# EAGLE board DumbBadgeFusion (EAGLE 9.6.2), part 1 of 2
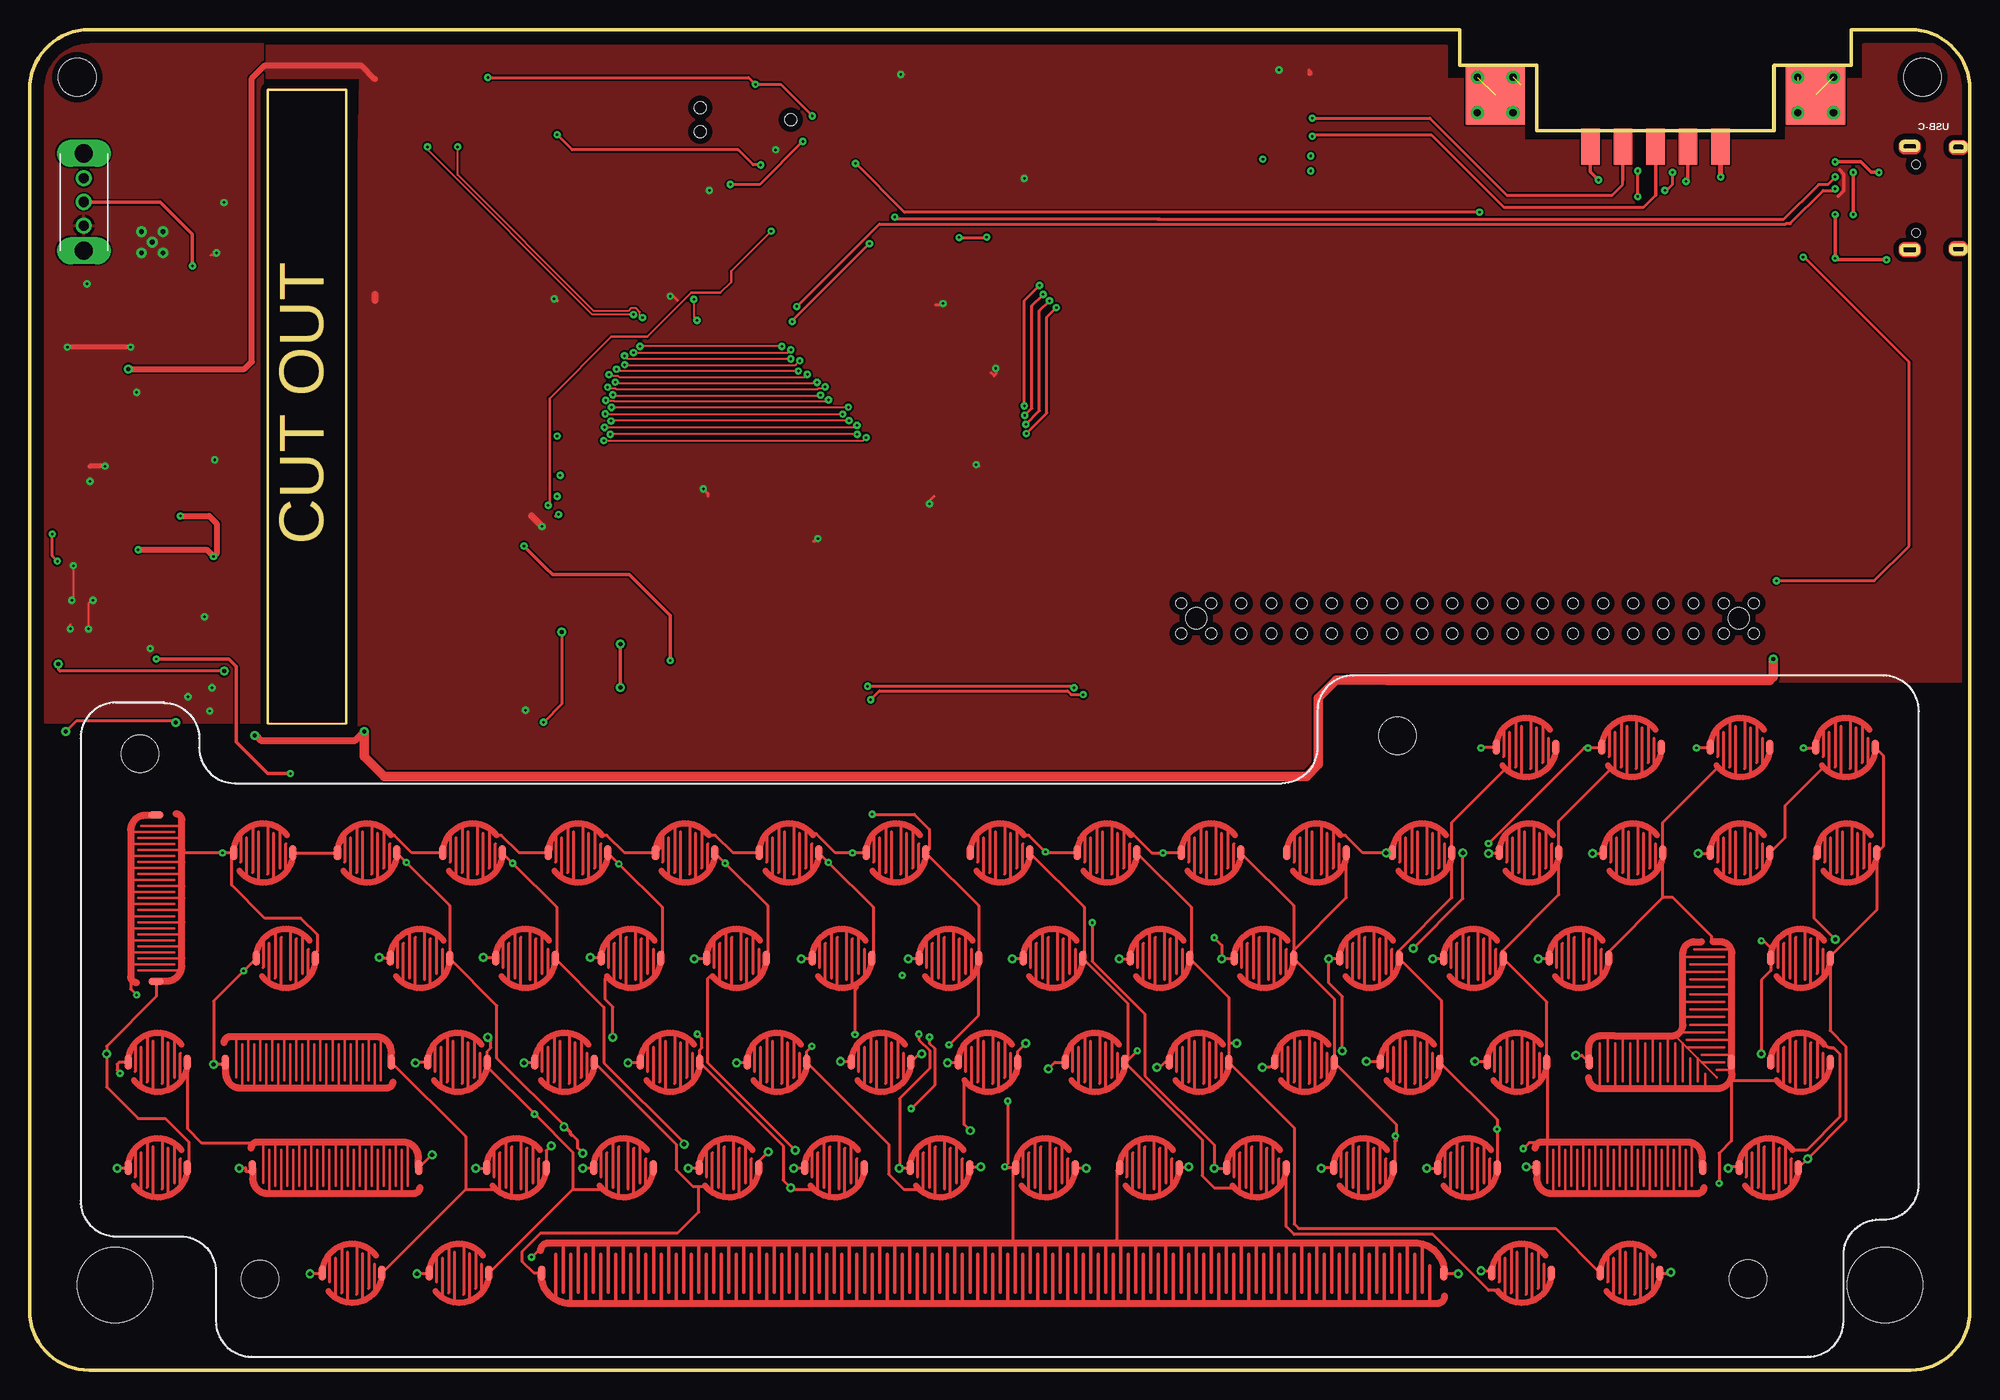
[diagram p3: board, top side]
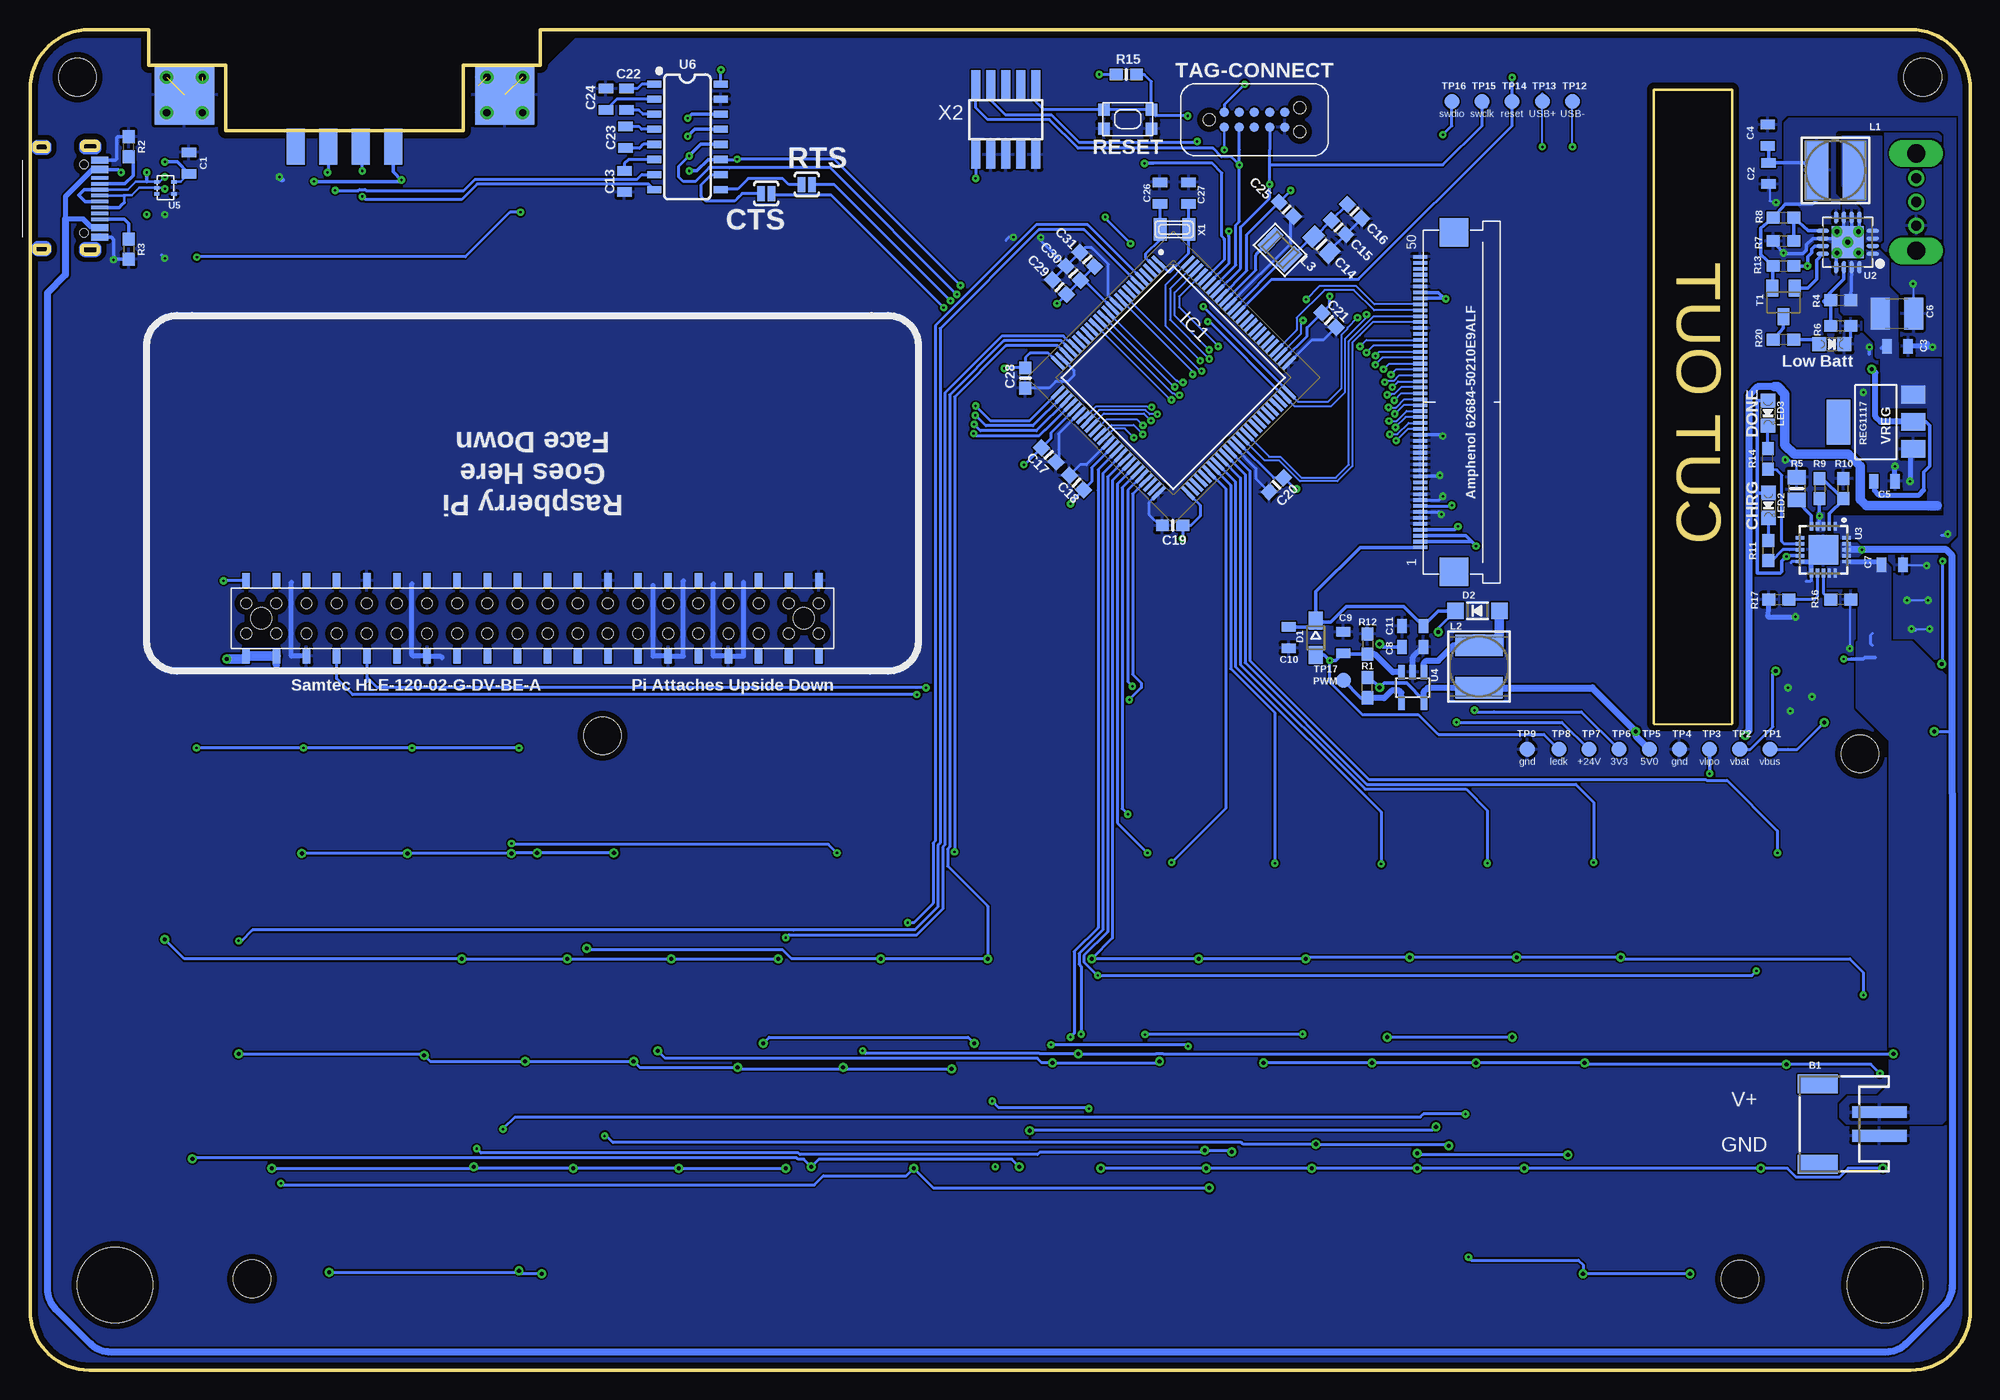
[diagram p4: board, bottom side, seen from below]

Size 163.5 x 113 mm. Coordinates in mm from the lower left corner, seen from the top.
Outline: 20.07,107.95 20.19,107.95
Outline: 20.19,107.95 20.32,107.95
Outline: 20.32,107.95 20.45,107.95
Outline: 20.45,107.95 20.57,107.95
Outline: 20.57,107.95 20.7,107.95
Outline: 20.7,107.95 20.95,107.95
Outline: 20.95,107.95 26.67,107.95
Outline: 26.67,107.95 26.67,54.48
Outline: 26.67,54.48 20.07,54.48
Outline: 20.07,54.48 20.07,55.37
Outline: 20.07,55.37 20.07,107.44
Outline: 20.07,107.44 20.07,107.57
Outline: 20.07,107.57 20.07,107.82
Outline: 20.07,107.82 20.07,107.95
Outline: 20.32,107.95 20.45,107.95
Outline: 20.45,107.95 20.57,107.95
Outline: 20.57,107.95 20.7,107.95
Outline: 20.7,107.95 20.95,107.95
Outline: 20.95,107.95 26.67,107.95
Outline: 26.67,107.95 26.67,54.48
Outline: 26.67,54.48 20.07,54.48
Outline: 20.07,54.48 20.07,55.37
Outline: 20.07,55.37 20.07,107.44
Outline: 20.07,107.44 20.07,107.57
Outline: 20.07,107.57 20.07,107.82
Outline: 20.07,107.82 20.07,107.95
Outline: 20.07,107.95 20.19,107.95
Outline: 20.19,107.95 20.32,107.95
Outline: 20.32,107.95 20.45,107.95
Outline: 20.45,107.95 20.57,107.95
Outline: 20.57,107.95 20.7,107.95
Outline: 20.7,107.95 20.95,107.95
Outline: 20.95,107.95 20.19,107.95
Outline: 158.5,0 arc90 163.5,5 163.5,108 arc90 158.5,113 153.5,113 153.5,110 147,110 147,104.5 127,104.5 127,110 120.5,110 120.5,113 5,113 arc90 0,108 0,5 arc90 5,0 158.5,0
Outline: 162.15,103.48 162.89,103.48 arc-90 163.14,103.23 163.14,102.95 arc-90 162.84,102.77 162.18,102.77 arc-90 161.93,102.89 161.93,103.25 arc-90 162.15,103.48
Outline: 158.04,103.58 158.83,103.58 arc-90 159.16,103.25 159.16,103.02 arc-90 158.85,102.84 158.04,102.84 arc-90 157.71,103.05 157.71,103.25 arc-90 158.04,103.58
Outline: 158.01,94.79 158.85,94.79 arc-90 159.16,94.61 159.16,94.36 arc-90 158.88,94.08 158.01,94.08 arc-90 157.71,94.39 157.71,94.61 arc-90 158.01,94.79
Outline: 162.2,94.84 162.81,94.84 arc-90 163.14,94.64 163.14,94.41 arc-90 162.87,94.13 162.2,94.13 arc-90 161.9,94.44 161.9,94.67 arc-90 162.2,94.84
Copper layers (1*16): Top 0.035mm / dielectric 1.5mm / Bottom 0.035mm
Design rules "default *": minimum track width 3mil, minimum drill 7mil, track to track 6mil, track to pad 6mil, pad to pad 6mil, via to via 6mil, smd to smd 6mil, copper to edge 20mil, drill to drill 6mil, minimum pad ring 10mil, minimum via ring 8mil, stop-mask expansion 4mil, vias tented up to drill 25mil, thermal gap 10mil
Net classes: 1 diff_pairs: width 0.254 mm, clearance 0.102 mm
Holes 3.15 mm at 115.26,53.48 144.8,7.7 19.41,7.69 9.29,51.98
Holes 3.17 mm at 4,109 159.5,109
Holes 6.35 mm at 7.17,7.17 156.32,7.17
bRestrict: area 20.1,54.5 to 26.7,108
Milling: 22 lines

## Footprints (pad centres in the part's own frame; a part is rotated, then mirrored left to right if it is on the bottom)
JSTPH2 = smd 1 x 4.6: 1 -1,-3.7; 2 1,-3.7 | smd 1.6 x 3.4: NC1 -3.4,1.5; NC2 3.4,1.5
0805 = smd 0.8 x 1.2: 1 -0.9,0; 2 0.9,0
C1210 = smd 1.6 x 2.7: 1 -1.4,0; 2 1.4,0
0805-NO = smd 1.24 x 1.5: 1 -0.95,0; 2 0.95,0
0603-NO = smd 1.075 x 1: 1 -0.85,0; 2 0.85,0
SOD323-W = smd 1.5 x 1.2: A 1.45,0; C -1.45,0
SOD-123 = smd 1.4 x 1.4: A 1.85,0; C -1.85,0
DE09S065TLF = drill 0.6: G1 -15,4.5; G2 -12,4.5; G3 -15,1.5; G4 -12,1.5; G5 12,4.5; G6 15,4.5; G7 12,1.5; G8 15,1.5 | smd 5 x 5 bottom: G9 13.5,3; G10 -13.5,3 | smd 5 x 5: G11 -13.5,3; G12 13.5,3 | smd 1.54 x 3: P1 5.48,-1.37; P2 2.74,-1.37; P3 0,-1.37; P4 -2.74,-1.37; P5 -5.48,-1.37 | smd 1.54 x 3 bottom: P6 4.11,-1.37; P7 1.37,-1.37; P8 -1.37,-1.37; P9 -4.11,-1.37
62684-501100ALF = smd 0.3 x 1.2: A1 -12.25,0.25; A2 -11.75,0.25; A3 -11.25,0.25; A4 -10.75,0.25; A5 -10.25,0.25; A6 -9.75,0.25; A7 -9.25,0.25; A8 -8.75,0.25; A9 -8.25,0.25; A10 -7.75,0.25; A11 -7.25,0.25; A12 -6.75,0.25; A13 -6.25,0.25; A14 -5.75,0.25; A15 -5.25,0.25; A16 -4.75,0.25; A17 -4.25,0.25; A18 -3.75,0.25; A19 -3.25,0.25; A20 -2.75,0.25; A21 -2.25,0.25; A22 -1.75,0.25; A23 -1.25,0.25; A24 -0.75,0.25; A25 -0.25,0.25; A26 0.25,0.25; A27 0.75,0.25; A28 1.25,0.25; A29 1.75,0.25; A30 2.25,0.25; A31 2.75,0.25; A32 3.25,0.25; A33 3.75,0.25; A34 4.25,0.25; A35 4.75,0.25; A36 5.25,0.25; A37 5.75,0.25; A38 6.25,0.25; A39 6.75,0.25; A40 7.25,0.25; A41 7.75,0.25; A42 8.25,0.25; A43 8.75,0.25; A44 9.25,0.25; A45 9.75,0.25; A46 10.25,0.25; A47 10.75,0.25; A48 11.25,0.25; A49 11.75,0.25; A50 12.25,0.25 | smd 2.4 x 2.4: S1 -14.3,-2.6; S2 14.3,-2.6
QFP50P1600X1600X120-100N = smd 1.475 x 0.3: 1 -7.738,6; 2 -7.738,5.5; 3 -7.738,5; 4 -7.738,4.5; 5 -7.738,4; 6 -7.738,3.5; 7 -7.738,3; 8 -7.738,2.5; 9 -7.738,2; 10 -7.738,1.5; 11 -7.738,1; 12 -7.738,0.5; 13 -7.738,0; 14 -7.738,-0.5; 15 -7.738,-1; 16 -7.738,-1.5; 17 -7.738,-2; 18 -7.738,-2.5; 19 -7.738,-3; 20 -7.738,-3.5; 21 -7.738,-4; 22 -7.738,-4.5; 23 -7.738,-5; 24 -7.738,-5.5; 25 -7.738,-6; 51 7.738,-6; 52 7.738,-5.5; 53 7.738,-5; 54 7.738,-4.5; 55 7.738,-4; 56 7.738,-3.5; 57 7.738,-3; 58 7.738,-2.5; 59 7.738,-2; 60 7.738,-1.5; 61 7.738,-1; 62 7.738,-0.5; 63 7.738,0; 64 7.738,0.5; 65 7.738,1; 66 7.738,1.5; 67 7.738,2; 68 7.738,2.5; 69 7.738,3; 70 7.738,3.5; 71 7.738,4; 72 7.738,4.5; 73 7.738,5; 74 7.738,5.5; 75 7.738,6 | smd 0.3 x 1.475: 26 -6,-7.738; 27 -5.5,-7.738; 28 -5,-7.738; 29 -4.5,-7.738; 30 -4,-7.738; 31 -3.5,-7.738; 32 -3,-7.738; 33 -2.5,-7.738; 34 -2,-7.738; 35 -1.5,-7.738; 36 -1,-7.738; 37 -0.5,-7.738; 38 0,-7.738; 39 0.5,-7.738; 40 1,-7.738; 41 1.5,-7.738; 42 2,-7.738; 43 2.5,-7.738; 44 3,-7.738; 45 3.5,-7.738; 46 4,-7.738; 47 4.5,-7.738; 48 5,-7.738; 49 5.5,-7.738; 50 6,-7.738; 76 6,7.738; 77 5.5,7.738; 78 5,7.738; 79 4.5,7.738; 80 4,7.738; 81 3.5,7.738; 82 3,7.738; 83 2.5,7.738; 84 2,7.738; 85 1.5,7.738; 86 1,7.738; 87 0.5,7.738; 88 0,7.738; 89 -0.5,7.738; 90 -1,7.738; 91 -1.5,7.738; 92 -2,7.738; 93 -2.5,7.738; 94 -3,7.738; 95 -3.5,7.738; 96 -4,7.738; 97 -4.5,7.738; 98 -5,7.738; 99 -5.5,7.738; 100 -6,7.738
SILICONE_SWITCH = smd 0.635 x 1.27: P$1 -2.5,0; P$2 2.5,0
SILICONE_SWITCH_2U = smd 0.635 x 1.27: P$1 -7,0; P$2 7,0
SILICONE_RETURN = smd 0.635 x 1.27: P$1 -6,0; P$2 6,0
SILICONE_SPACE = smd 0.635 x 1.27: P$1 -38,0; P$2 38,0
INDUCTOR_5X5MM_TDK_VLC5045 = smd 2 x 5: P$1 -1.6,0; P$2 1.6,0
INDUCTOR_5X5MM_NR5040_NOTHERMALS = smd 1.8 x 4: P$1 -1.8,0; P$2 1.8,0
INDUCTOR_1007 = smd 1.016 x 2.2: P$1 -1.127,0; P$2 1.127,0
CHIPLED_0805_NOOUTLINE = smd 1.2 x 1.2: A 0,-1.05; C 0,1.05
0603 = smd 1.1 x 1: 1 -0.85,0; 2 0.85,0
SJ_2S-NO = smd 0.635 x 1.27: 1 -0.45,0; 2 0.45,0
KMR2 = smd 1 x 1: 1 2,0.8; 2 2,-0.8; 3 -2,0.8; 4 -2,-0.8
SC59-BEC = smd 1 x 1.4: B -0.95,-1.2; C 0,1.2; E 0.95,-1.2
TC2050-IDC-NL = smd 0.787 x 0.787: P$1 -2.54,-0.635; P$2 -1.27,-0.635; P$3 0,-0.635; P$4 1.27,-0.635; P$5 2.54,-0.635; P$6 2.54,0.635; P$7 1.27,0.635; P$8 0,0.635; P$9 -1.27,0.635; P$10 -2.54,0.635 | hole 0.991: 3.81,1.016; 3.81,-1.016; -3.81,0
B1,27 = smd 1.27 x 1.27: TP 0,0
PVQFN-16 = smd 1.05 x 0.35: 1 -2.1,0.975; 2 -2.1,0.325; 3 -2.1,-0.325; 4 -2.1,-0.975; 9 2.1,-0.975; 10 2.1,-0.325; 11 2.1,0.325; 12 2.1,0.975 | smd 0.35 x 1.05: 5 -0.975,-2.1; 6 -0.325,-2.1; 7 0.325,-2.1; 8 0.975,-2.1; 13 0.975,2.1; 14 0.325,2.1; 15 -0.325,2.1; 16 -0.975,2.1 | drill 0.4: P$18 0,0; P$19 -0.9,0.9; P$20 0.9,0.9; P$21 0.9,-0.9; P$22 -0.9,-0.9 | smd 2.7 x 2.7: THERMAL 0,0
QFN20_4MM = smd 0.73 x 0.28: P$1 -1.965,1; P$2 -1.965,0.5; P$3 -1.965,0; P$4 -1.965,-0.5; P$5 -1.965,-1; P$11 1.965,-1; P$12 1.965,-0.5; P$13 1.965,0; P$14 1.965,0.5; P$15 1.965,1 | smd 0.28 x 0.73: P$6 -1,-1.965; P$7 -0.5,-1.965; P$8 0,-1.965; P$9 0.5,-1.965; P$10 1,-1.965; P$16 1,1.965; P$17 0.5,1.965; P$18 0,1.965; P$19 -0.5,1.965; P$20 -1,1.965 | smd 2.5 x 2.5: P$21 0,0
SOT23-5@1 = smd 0.55 x 1.2: 1 -0.95,-1.3; 2 0,-1.3; 3 0.95,-1.3; 4 0.95,1.3; 5 -0.95,1.3
SOT(5) = smd 0.3 x 0.45: GND 0.5,-0.725; IO1 -0.5,-0.725; IO2 0,-0.725; IO3 0.5,0.725; VCC -0.5,0.725
SO16 = smd 0.6 x 1.2: 1 -4.445,-2.8; 2 -3.175,-2.8; 3 -1.905,-2.8; 4 -0.635,-2.8; 5 0.635,-2.8; 6 1.905,-2.8; 7 3.175,-2.8; 8 4.445,-2.8; 9 4.445,2.8; 10 3.175,2.8; 11 1.905,2.8; 12 0.635,2.8; 13 -0.635,2.8; 14 -1.905,2.8; 15 -3.175,2.8; 16 -4.445,2.8
OS102011MA1QN1 = drill 1.524 pad 2 long: CASE1 0,0; CASE2 8.204,0 | drill 0.85 pad 1.27: P$1 2.108,0; P$2 4.115,0; P$3 6.121,0
HLE-120-02-G-DV-BE-A--REVERSEMOUNT = smd 0.635 x 1.27: P1 24.13,-3.175; P2 24.13,3.175; P3 21.59,-3.175; P4 21.59,3.175; P5 19.05,-3.175; P6 19.05,3.175; P7 16.51,-3.175; P8 16.51,3.175; P9 13.97,-3.175; P10 13.97,3.175; P11 11.43,-3.175; P12 11.43,3.175; P13 8.89,-3.175; P14 8.89,3.175; P15 6.35,-3.175; P16 6.35,3.175; P17 3.81,-3.175; P18 3.81,3.175; P19 1.27,-3.175; P20 1.27,3.175; P21 -1.27,-3.175; P22 -1.27,3.175; P23 -3.81,-3.175; P24 -3.81,3.175; P25 -6.35,-3.175; P26 -6.35,3.175; P27 -8.89,-3.175; P28 -8.89,3.175; P29 -11.43,-3.175; P30 -11.43,3.175; P31 -13.97,-3.175; P32 -13.97,3.175; P33 -16.51,-3.175; P34 -16.51,3.175; P35 -19.05,-3.175; P36 -19.05,3.175; P37 -21.59,-3.175; P38 -21.59,3.175; P39 -24.13,-3.175; P40 -24.13,3.175 | hole 0.9: 1.27,1.27; 3.81,1.27; 6.35,1.27; 8.89,1.27; 11.43,1.27; 13.97,1.27; 16.51,1.27; 19.05,1.27; 21.59,1.27; 24.13,1.27; 24.13,-1.27; 21.59,-1.27; 19.05,-1.27; 16.51,-1.27; 13.97,-1.27; 11.43,-1.27; 8.89,-1.27; 6.35,-1.27; 3.81,-1.27; 1.27,-1.27; -1.27,-1.27; -3.81,-1.27; -6.35,-1.27; -8.89,-1.27; -11.43,-1.27; -13.97,-1.27; -16.51,-1.27; -19.05,-1.27; -21.59,-1.27; -24.13,-1.27; -24.13,1.27; -21.59,1.27; -19.05,1.27; -16.51,1.27; -13.97,1.27; -11.43,1.27; -8.89,1.27; -6.35,1.27; -3.81,1.27; -1.27,1.27 | hole 1.778: -22.86,0; 22.86,0
TYPE-C-31-M-12 = smd 0.6 x 1.45: A1B12 -3.25,0.8; A4B9 -2.45,0.8; B1A12 3.25,0.8; B4A9 2.45,0.8 | smd 0.3 x 1.45: A5 -1.25,0.8; A6 -0.25,0.8; A7 0.25,0.8; A8 1.25,0.8; B5 1.75,0.8; B6 0.75,0.8; B7 -0.75,0.8; B8 -1.75,0.8 | hole 0.7: -2.89,-0.53; 2.89,-0.53
SOT223 = smd 1.499 x 2.007: 1 -2.261,-3.15; 2 0.025,-3.15; 3 2.311,-3.15 | smd 3.81 x 2.007: 4 0,3.15
XTAL3215 = smd 1.1 x 1.9: P$1 1.2,0; P$2 -1.2,0
1365-10 = smd 0.76 x 2.4: 1 -2.54,-2.95; 2 -2.54,2.95; 3 -1.27,-2.95; 4 -1.27,2.95; 5 0,-2.95; 6 0,2.95; 7 1.27,-2.95; 8 1.27,2.95; 9 2.54,-2.95; 10 2.54,2.95

## Placement (x,y rotation side)
B1  JST 2-PH  [JSTPH2]  11.36,20.75 90 bottom
C1  0.1uF  [0805]  150.11,101.75 90 bottom
C2  10uF  [0805]  17,100.88 270 bottom
C3  2.2uF  [0805]  6.14,86.31 0 bottom
C4  0.1uF  [0805]  17.08,104.1 90 bottom
C5  1.0uF  [0805]  7.24,74.93 0 bottom
C6  100uF  [C1210]  6.18,89.07 0 bottom
C7  10uF  [0805]  6.59,67.89 0 bottom
C8  10uF  [0805]  46.99,60.96 0 bottom
C9  0.1uF  [0805]  52.83,61.34 90 bottom
C10  1.0uF  [0805]  57.43,61.76 270 bottom
C11  1.0uF  [0805]  46.99,62.74 180 bottom
C13  1.0uF  [0805]  113.41,100.2 270 bottom
C14  10uF  [0805-NO]  54.67,94.89 315 bottom
C15  1uF  [0603-NO]  53.24,96.33 315 bottom
C16  .1u  [0603-NO]  51.89,97.68 135 bottom
C17  .1u  [0603-NO]  77.66,77.15 135 bottom
C18  .1u  [0603-NO]  75.32,74.82 315 bottom
C19  .1u  [0603-NO]  67.22,71.22 0 bottom
C20  .1u  [0603-NO]  58.48,74.63 45 bottom
C21  .1u  [0603-NO]  54.04,88.52 135 bottom
C22  0.1uF  [0805]  113.25,107.12 270 bottom
C23  0.1uF  [0805]  113.32,103.92 270 bottom
C24  0.1uF  [0805]  114.97,107.13 90 bottom
C25  .1u  [0603-NO]  57.64,97.85 135 bottom
C26  22pF  [0805]  68.29,99.23 270 bottom
C27  22pF  [0805]  65.88,99.23 270 bottom
C28  .1u  [0603-NO]  79.63,83.64 90 bottom
C29  .1u  [0603-NO]  76.76,91.3 315 bottom
C30  .1u  [0603-NO]  75.59,92.46 315 bottom
C31  .1u  [0603-NO]  74.42,93.63 315 bottom
D1  MM3Z24VT1G  [SOD323-W]  55.16,61.75 270 bottom
D2  MBR0540  [SOD-123]  41.53,64.01 0 bottom
DE9FEMALE  EDGEMOUNTDE9  [DE09S065TLF]  137,104.5 0 top
FPC50CONN  50PINFPC  [62684-501100ALF]  46.1,81.6 90 bottom
IC1  ATSAMD51N19A-AU  [QFP50P1600X1600X120-100N]  67.16,83.67 315 bottom
K-1  1U_PAD  [SILICONE_SWITCH]  28.44,43.6 0 top
K-2  1U_PAD  [SILICONE_SWITCH]  37.33,43.6 0 top
K-5  1U_PAD  [SILICONE_SWITCH]  64,43.6 0 top
K_0  1U_PAD  [SILICONE_SWITCH]  108.45,43.6 0 top
K_3  1U_PAD  [SILICONE_SWITCH]  46.22,43.6 0 top
K_4  1U_PAD  [SILICONE_SWITCH]  55.24,43.6 0 top
K_6  1U_PAD  [SILICONE_SWITCH]  73.02,43.6 0 top
K_7  1U_PAD  [SILICONE_SWITCH]  81.78,43.6 0 top
K_8  1U_PAD  [SILICONE_SWITCH]  90.8,43.6 0 top
K_9  1U_PAD  [SILICONE_SWITCH]  99.56,43.6 0 top
K_<  1U_PAD  [SILICONE_SWITCH]  103.37,17.06 0 top
K_>  1U_PAD  [SILICONE_SWITCH]  112.39,17.06 0 top
K_?  1U_PAD  [SILICONE_SWITCH]  121.15,17.06 0 top
K_A  1U_PAD  [SILICONE_SWITCH]  36.06,25.95 0 top
K_B  1U_PAD  [SILICONE_SWITCH]  76.7,17.06 0 top
K_BACK  1U_PAD  [SILICONE_SWITCH]  144.14,43.6 0 top
K_BREAK  1U_PAD  [SILICONE_SWITCH]  153.15,43.6 0 top
K_C  1U_PAD  [SILICONE_SWITCH]  58.92,17.06 0 top
K_CAPS  1U_PAD  [SILICONE_SWITCH]  10.79,25.95 0 top
K_CONTROL  2U_PAD  [SILICONE_SWITCH_2U]  23.49,25.95 0 top
K_D  1U_PAD  [SILICONE_SWITCH]  53.97,25.95 0 top
K_DEL  1U_PAD  [SILICONE_SWITCH]  149.22,34.71 0 top
K_DOWN  1U_PAD  [SILICONE_SWITCH]  134.99,52.49 0 top
K_E  1U_PAD  [SILICONE_SWITCH]  50.66,34.71 0 top
K_ESC  1U_PAD  [SILICONE_SWITCH]  19.68,43.6 180 top
K_F  1U_PAD  [SILICONE_SWITCH]  62.98,25.95 0 top
K_G  1U_PAD  [SILICONE_SWITCH]  71.75,25.95 0 top
K_H  1U_PAD  [SILICONE_SWITCH]  80.76,25.95 0 top
K_I  1U_PAD  [SILICONE_SWITCH]  95.24,34.71 0 top
K_J  1U_PAD  [SILICONE_SWITCH]  89.78,25.95 0 top
K_K  1U_PAD  [SILICONE_SWITCH]  98.54,25.95 0 top
K_L  1U_PAD  [SILICONE_SWITCH]  107.43,25.95 0 top
K_LEFT  1U_PAD  [SILICONE_SWITCH]  126.1,52.49 0 top
K_LEFTALT  1U_PAD  [SILICONE_SWITCH]  36.19,8.17 0 top
K_LEFTMETA  1U_PAD  [SILICONE_SWITCH]  27.17,8.17 0 top
K_LINE  1U_PAD  [SILICONE_SWITCH]  146.55,17.06 0 top
K_LSHIFT  2U_PAD  [SILICONE_SWITCH_2U]  25.77,17.06 0 top
K_M  1U_PAD  [SILICONE_SWITCH]  94.35,17.06 0 top
K_N  1U_PAD  [SILICONE_SWITCH]  85.59,17.06 0 top
K_NOSCL  1U_PAD  [SILICONE_SWITCH]  10.79,17.06 0 top
K_O  1U_PAD  [SILICONE_SWITCH]  104,34.71 0 top
K_P  1U_PAD  [SILICONE_SWITCH]  112.89,34.71 0 top
K_PIPE  1U_PAD  [SILICONE_SWITCH]  149.22,25.95 0 top
K_PLUS  1U_PAD  [SILICONE_SWITCH]  126.36,43.6 0 top
K_Q  1U_PAD  [SILICONE_SWITCH]  32.88,34.71 0 top
K_QUOTE  1U_PAD  [SILICONE_SWITCH]  125.34,25.95 0 top
K_R  1U_PAD  [SILICONE_SWITCH]  59.55,34.71 0 top
K_RETURN  RETURN_PAD  [SILICONE_RETURN]  137.41,25.95 0 top
K_RIGHT  1U_PAD  [SILICONE_SWITCH]  153.03,52.49 0 top
K_RIGHTALT  1U_PAD  [SILICONE_SWITCH]  125.72,8.17 0 top
K_RIGHTMETA  1U_PAD  [SILICONE_SWITCH]  134.87,8.17 180 top
K_RSHIFT  2U_PAD  [SILICONE_SWITCH_2U]  133.98,17.06 0 top
K_S  1U_PAD  [SILICONE_SWITCH]  45.08,25.95 0 top
K_SEMI  1U_PAD  [SILICONE_SWITCH]  116.32,25.95 0 top
K_SETUP  2U_PAD  [SILICONE_SWITCH_2U]  10.66,39.79 270 top
K_SPACE  SPACE_PAD  [SILICONE_SPACE]  81.14,8.17 180 top
K_T  1U_PAD  [SILICONE_SWITCH]  68.44,34.71 0 top
K_TAB  1U_PAD  [SILICONE_SWITCH]  21.58,34.71 0 top
K_TILDE  1U_PAD  [SILICONE_SWITCH]  135.12,43.6 0 top
K_U  1U_PAD  [SILICONE_SWITCH]  86.22,34.71 0 top
K_UP  1U_PAD  [SILICONE_SWITCH]  144.14,52.49 0 top
K_USCORE  1U_PAD  [SILICONE_SWITCH]  117.34,43.6 0 top
K_V  1U_PAD  [SILICONE_SWITCH]  67.81,17.06 0 top
K_W  1U_PAD  [SILICONE_SWITCH]  41.77,34.71 0 top
K_X  1U_PAD  [SILICONE_SWITCH]  50.03,17.06 0 top
K_Y  1U_PAD  [SILICONE_SWITCH]  77.46,34.71 0 top
K_Z  1U_PAD  [SILICONE_SWITCH]  41.01,17.06 0 top
K_{  1U_PAD  [SILICONE_SWITCH]  121.66,34.71 0 top
K_}  1U_PAD  [SILICONE_SWITCH]  130.55,34.71 0 top
L1  6.8uH  [INDUCTOR_5X5MM_TDK_VLC5045]  11.36,101.14 0 bottom
L2  6.8uH power L CID 2276  [INDUCTOR_5X5MM_NR5040_NOTHERMALS]  41.4,59.31 90 bottom
L3  10uH  [INDUCTOR_1007]  58.18,94.44 135 bottom
LED1  LOW BATT  [CHIPLED_0805_NOOUTLINE]  11.68,86.48 270 bottom
LED2  ORANGE  [CHIPLED_0805_NOOUTLINE]  17.02,72.9 180 bottom
LED3  GREEN  [CHIPLED_0805_NOOUTLINE]  17.05,80.68 180 bottom
R1  10k  [0603]  50.8,57.53 90 bottom
R2  5.1k  [0603]  155.19,103.12 90 bottom
R3  5.1k  [0603]  155.19,94.49 270 bottom
R4  1.87M  [0603]  10.92,90.2 0 bottom
R5  NCP21XW153J03RA  [0805-NO]  14.63,74.32 270 bottom
R6  200k  [0603]  10.92,88.03 180 bottom
R7  340k  [0603]  15.75,95.19 0 bottom
R8  1.87M  [0603]  15.75,97.14 180 bottom
R9  270k  [0603]  12.71,74.31 270 bottom
R10  100k  [0603]  10.71,74.31 90 bottom
R11  1k  [0603]  17.02,69.09 90 bottom
R12  6 Ohm  [0603]  50.8,61.21 270 bottom
R13  200k  [0603]  15.75,93.08 0 bottom
R14  1k  [0603]  17.05,76.82 90 bottom
R15  10K  [0603-NO]  71.12,109.22 0 bottom
R16  1k  [0603]  10.92,64.96 180 bottom
R17  100k  [0603]  16.14,64.96 0 bottom
R20  1k  [0603]  15.75,86.88 180 bottom
SJ1  SOLDERJUMPERNO  [SJ_2S-NO]  101.47,99.19 0 bottom
SJ2  SOLDERJUMPERNO  [SJ_2S-NO]  98.04,99.95 0 bottom
SW1  SPST_TACT-KMR2  [KMR2]  71,105.46 0 bottom
T1  MMUN2133LT1G  [SC59-BEC]  15.75,90.01 180 bottom
TAG-CONNECT  TC2050-IDC-NL  [TC2050-IDC-NL]  60.33,105.41 0 bottom
TP1  TPB1,27  [B1,27]  16.89,52.32 0 bottom
TP2  TPB1,27  [B1,27]  19.43,52.32 0 bottom
TP3  TPB1,27  [B1,27]  21.97,52.32 0 bottom
TP4  TPB1,27  [B1,27]  24.51,52.32 0 bottom
TP5  TPB1,27  [B1,27]  27.05,52.32 0 bottom
TP6  TPB1,27  [B1,27]  29.59,52.32 0 bottom
TP7  TPB1,27  [B1,27]  32.13,52.32 0 bottom
TP8  TPB1,27  [B1,27]  34.67,52.32 0 bottom
TP9  TPB1,27  [B1,27]  37.34,52.32 0 bottom
TP12  TPB1,27  [B1,27]  33.53,106.93 0 bottom
TP13  TPB1,27  [B1,27]  36.07,106.93 0 bottom
TP14  TPB1,27  [B1,27]  38.61,106.93 0 bottom
TP15  TPB1,27  [B1,27]  41.15,106.93 0 bottom
TP16  TPB1,27  [B1,27]  43.69,106.93 0 bottom
TP17  TPB1,27  [B1,27]  52.83,58.17 0 bottom
U2  TPS61090RSAR  [PVQFN-16]  10.33,95.08 180 bottom
U3  MCP73871  [QFN20_4MM]  12.39,69.16 270 bottom
U4  FAN5333BSX  [SOT23-5@1]  46.99,57.53 180 bottom
U5  TPD3E001SOT5  [SOT(5)]  152.1,99.67 270 bottom
U6  MAX3232  [SO16]  108.1,103.96 270 bottom
U$5  OS102011MA1QN1  [OS102011MA1QN1]  4.57,94.36 90 top
U$30  SAMTEC_PI_REVERSE  [HLE-120-02-G-DV-BE-A--REVERSEMOUNT]  121.16,63.37 180 bottom
USB  TYPE-C-31-M-12  [TYPE-C-31-M-12]  158.43,98.76 270 bottom
VREG  REG1117  [SOT223]  7.96,79.92 90 bottom
X1  NX3215SA-32.768K-STD-MUA-8  [XTAL3215]  67.07,96.17 0 bottom
X2  1365-10  [1365-10]  81.28,105.41 0 bottom